# EAGLE design Controller (EAGLE 6.4)
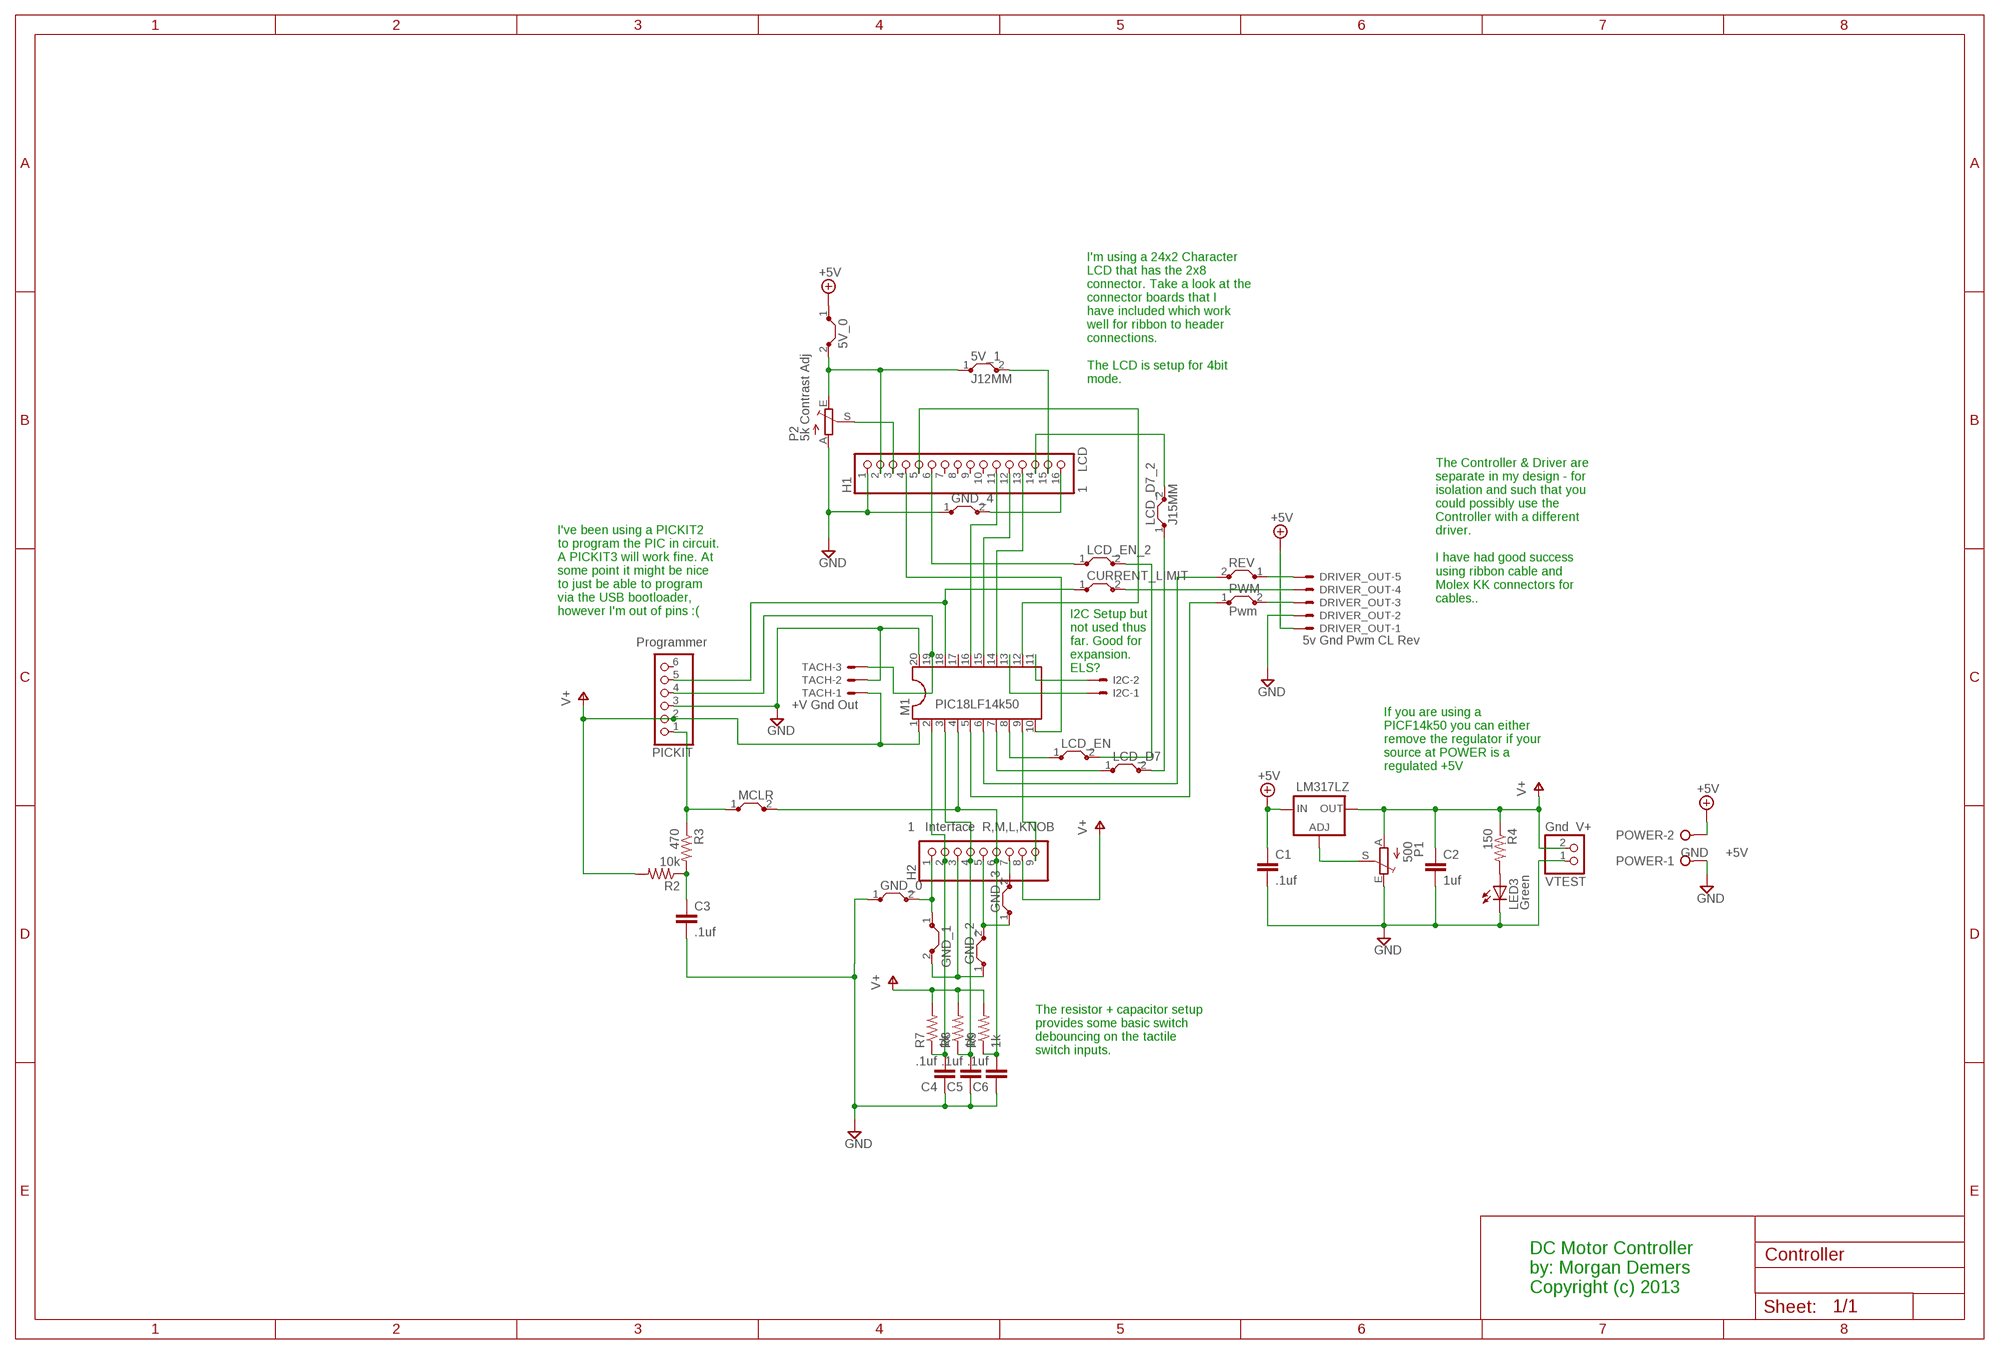
[diagram p0: schematic, sheet 1]

## Parts
5V_0  J5MM  [05]
5V_1  J12MM  [12]
C1  .1uf  C2,5-3  [C2.5-3]
C2  1uf  C2,5-3  [C2.5-3]
C3  .1uf  C2,5-3  [C2.5-3]
C4  .1uf  C5/2.5  [C5B2.5]
C5  .1uf  C5/2.5  [C5B2.5]
C6  .1uf  C5/2.5  [C5B2.5]
CURRENT_LIMIT  J30MM  [30]
DRIVER_OUT  5v Gnd Pwm CL Rev  22-23-2051  [22-23-2051]
GND_0  J10MM  [10]
GND_1  J5MM  [05]
GND_2  J5MM  [05]
GND_3  J5MM  [05]
GND_4  J10MM  [10]
H1  1 LCD  PINHD-1X16  [1X16]
H2  1 Interface R,M,L,KNOB  PINHD-1X9  [1X09]
I2C  22-23-2021  [22-23-2021]
LCD_D7  J7MM  [07]
LCD_D7_2  J15MM  [15]
LCD_EN  J7MM  [07]
LCD_EN_2  J7MM  [07]
LED3  Green  LEDLSU260  [LSU260]
LM317LZ  LM317L  [317L]
M1  PIC18LF14k50  DIL20  [DIL20]
MCLR  J15MM  [15]
P1  500  TRIM_EU-B25P  [B25P]
P2  5k Contrast Adj  TRIM_EU-B25P  [B25P]
PICKIT  Programmer  PINHD-1X6/90  [1X06/90]
POWER  GND +5V  W237-02P  [W237-132]
PWM  Pwm  J7MM  [07]
R2  10k  R-US_0204/2V  [0204V]
R3  470  R-US_0204/2V  [0204V]
R4  150  R-US_0204/2V  [0204V]
R7  1k  R-US_0204/2V  [0204V]
R8  1k  R-US_0204/2V  [0204V]
R9  1k  R-US_0204/2V  [0204V]
REV  J10MM  [10]
TACH  +V Gnd Out  22-23-2031  [22-23-2031]
VTEST  Gnd V+  PINHD-1X2  [1X02]

## Nets
+5V: 5V_0.1 C1.1 DRIVER_OUT.1 LM317LZ.3(IN) POWER.2
+5V_J0: 5V_0.2 5V_1.1 H1.2 P2.E
GND: C1.2 C2.2 C3.2 C4.1 C5.1 C6.1 DRIVER_OUT.2 GND_0.1 GND_4.1 H1.1 LED3.K(C) M1.20 P1.E P2.A PICKIT.3 POWER.1 TACH.2 VTEST.1
GND_J0: GND_0.2 GND_1.1 H2.1
GND_J1: GND_1.2 GND_2.1 H2.3
GND_J3: GND_2.2 GND_3.1 H2.5
GND_J4: GND_3.2 H2.7
LMADJ: LM317LZ.1(ADJ) P1.S
N$1: 5V_1.2 H1.15
N$2: LED3.A R4.2
N$3: GND_4.2 H1.16
S$2: MCLR.1 PICKIT.1 R3.1
S$3: I2C.2 M1.11
S$4: H2.9 M1.9
S$5: H1.3 P2.S
S$6: H1.14 LCD_D7_2.2
S$7: H1.6 LCD_EN_2.1
S$8: H1.4 M1.10
S$9: LCD_EN.2 LCD_EN_2.2
S$14: H1.5 M1.12
S$16: C4.2 H2.2 M1.2 R7.1
S$18: C3.1 R2.1 R3.2
S$19: H1.11 M1.16
S$20: LCD_EN.1 M1.8
S$21: H1.12 M1.15
S$22: H1.13 M1.14
S$23: M1.19 PICKIT.4 TACH.3
S$24: LCD_D7.1 M1.7
S$25: CURRENT_LIMIT.1 M1.18 PICKIT.5
S$26: C5.2 H2.4 M1.3 R8.1
S$27: LCD_D7.2 LCD_D7_2.1
S$30: M1.6 REV.2
S$31: I2C.1 M1.13
S$32: C6.2 H2.6 M1.4 MCLR.2 R9.1
S$34: M1.5 PWM.1
S$39: DRIVER_OUT.5 REV.1
S$40: CURRENT_LIMIT.2 DRIVER_OUT.4
S$41: DRIVER_OUT.3 PWM.2
V+: C2.1 H2.8 LM317LZ.2(OUT) M1.1 P1.A PICKIT.2 R2.2 R4.1 R7.2 R8.2 R9.2 TACH.1 VTEST.2
Unconnected: H1.7 H1.8 H1.9 H1.10 M1.17 PICKIT.6

## Notes on the sheet
- I'm using a 24x2 Character
  LCD that has the 2x8 
  connector. Take a look at the
  connector boards that I
  have included which work
  well for ribbon to header
  connections.
  
  The LCD is setup for 4bit
  mode.
- The Controller & Driver are
  separate in my design - for
  isolation and such that you
  could possibly use the 
  Controller with a different
  driver.
  
  I have had good success
  using ribbon cable and 
  Molex KK connectors for
  cables..
- I've been using a PICKIT2 
  to program the PIC in circuit.
  A PICKIT3 will work fine. At 
  some point it might be nice
  to just be able to program
  via the USB bootloader, 
  however I'm out of pins :(
- I2C Setup but
  not used thus
  far. Good for
  expansion.
  ELS?
- If you are using a
  PICF14k50 you can either
  remove the regulator if your
  source at POWER is a
  regulated +5V
- The resistor + capacitor setup
  provides some basic switch
  debouncing on the tactile
  switch inputs.
- DC Motor Controller
  by: Morgan Demers
  Copyright (c) 2013

## Library data of the parts
5V_0 5V_1 CURRENT_LIMIT GND_0 GND_1-GND_4 LCD_D7 LCD_D7_2 LCD_EN LCD_EN_2 MCLR PWM REV = jumper:J: Bridge
C1-C6 = capacitor-wima:C: CAPACITOR naming: grid - package width
DRIVER_OUT = con-molex:22-23-2051: .100" (2.54mm) Center Header - 5 Pin; MF: MOLEX; MPN: 22-23-2051; OC_FARNELL: 1462952; OC_NEWARK: 38C9178
H1 = pinhead:PINHD-1X16: PIN HEADER
H2 = pinhead:PINHD-1X9: PIN HEADER
I2C = con-molex:22-23-2021: .100" (2.54mm) Center Header - 2 Pin; MF: MOLEX; MPN: 22-23-2021; OC_FARNELL: 1462926; OC_NEWARK: 25C3832
LED3 = led:LED: LED OSRAM: - CHIPLED LG R971, LG N971, LY N971, LG Q971, LY Q971, LO R971, LY R971 LH N974, LH R974 LS Q976, LO Q976, LY Q976 LO Q996 - Hyper CHIPLED LW Q18S LB Q993, LB Q99A, LB R99A - SideLED LS A670, LO A670, LY A670, LG A670, LP A670 LB A673, LV A673, LT A673, LW A673 LH A674 LY A675 LS A676, LA A676, LO A676, LY A676, LW A676 LS A679, LY A679, LG A679 - Hyper Micro SIDELED® LS Y876, LA Y876, LO Y876, LY Y876 LT Y87S - SmartLED LW L88C, LW L88S LB L89C, LB L89S, LG L890 LS L89K, LO L89K, LY L89K LS L896, LA L896, LO L896, LY L896 - TOPLED LS T670, LO T670, LY T670, LG T670, LP T670 LSG T670, LSP T670, LSY T670, LOP T670, LYG T670 LG T671, LOG T671, LSG T671 LB T673, LV T673, LT T673, LW T673 LH T674 LS T676, LA T676, LO T676, LY T676, LB T676, LH T676, LSB T676, LW T676 LB T67C, LV T67C, LT T67C, LS T67K, LO T67K, LY T67K, LW E67C LS E67B, LA E67B, LO E67B, LY E67B, LB E67C, LV E67C, LT E67C LW T67C LS T679, LY T679, LG T679 LS T770, LO T770, LY T770, LG T770, LP T770 LB T773, LV T773, LT T773, LW T773 LH T774 LS E675, LA E675, LY E675, LS T675 LS T776, LA T776, LO T776, LY T776, LB T776 LHGB T686 LT T68C, LB T68C - Hyper Mini TOPLED® LB M676 - Mini TOPLED Santana® LG M470 LS M47K, LO M47K, LY M47K Source: http://www.osram.convergy.de LUXEON: - LUMILED® LXK2-PW12-R00, LXK2-PW12-S00, LXK2-PW14-U00, LXK2-PW14-V00 LXK2-PM12-R00, LXK2-PM12-S00, LXK2-PM14-U00 LXK2-PE12-Q00, LXK2-PE12-R00, LXK2-PE12-S00, LXK2-PE14-T00, LXK2-PE14-U00 LXK2-PB12-K00, LXK2-PB12-L00, LXK2-PB12-M00, LXK2-PB14-N00, LXK2-PB14-P00, LXK2-PB14-Q00 LXK2-PR12-L00, LXK2-PR12-M00, LXK2-PR14-Q00, LXK2-PR14-R00 LXK2-PD12-Q00, LXK2-PD12-R00, LXK2-PD12-S00 LXK2-PH12-R00, LXK2-PH12-S00 LXK2-PL12-P00, LXK2-PL12-Q00, LXK2-PL12-R00 Source: www.luxeon.com KINGBRIGHT: KA-3528ASYC Source: www.kingbright.com
LM317LZ = v-reg:LM317L: VOLTAGE REGULATOR
M1 = ic-package:DIL20: Dual In Line / Socket
P1 P2 = pot:TRIM_EU-: POTENTIOMETER
PICKIT = pinhead:PINHD-1X6: PIN HEADER
POWER = con-wago-508:W237-02P: WAGO SREW CLAMP; OC_FARNELL: unknown; OC_NEWARK: unknown
R2-R4 R7-R9 = resistor:R-US_: RESISTOR, American symbol
TACH = con-molex:22-23-2031: .100" (2.54mm) Center Header - 3 Pin; MF: MOLEX; MPN: 22-23-2031; OC_FARNELL: 1462950; OC_NEWARK: 30C0862
VTEST = pinhead:PINHD-1X2: PIN HEADER

## Board
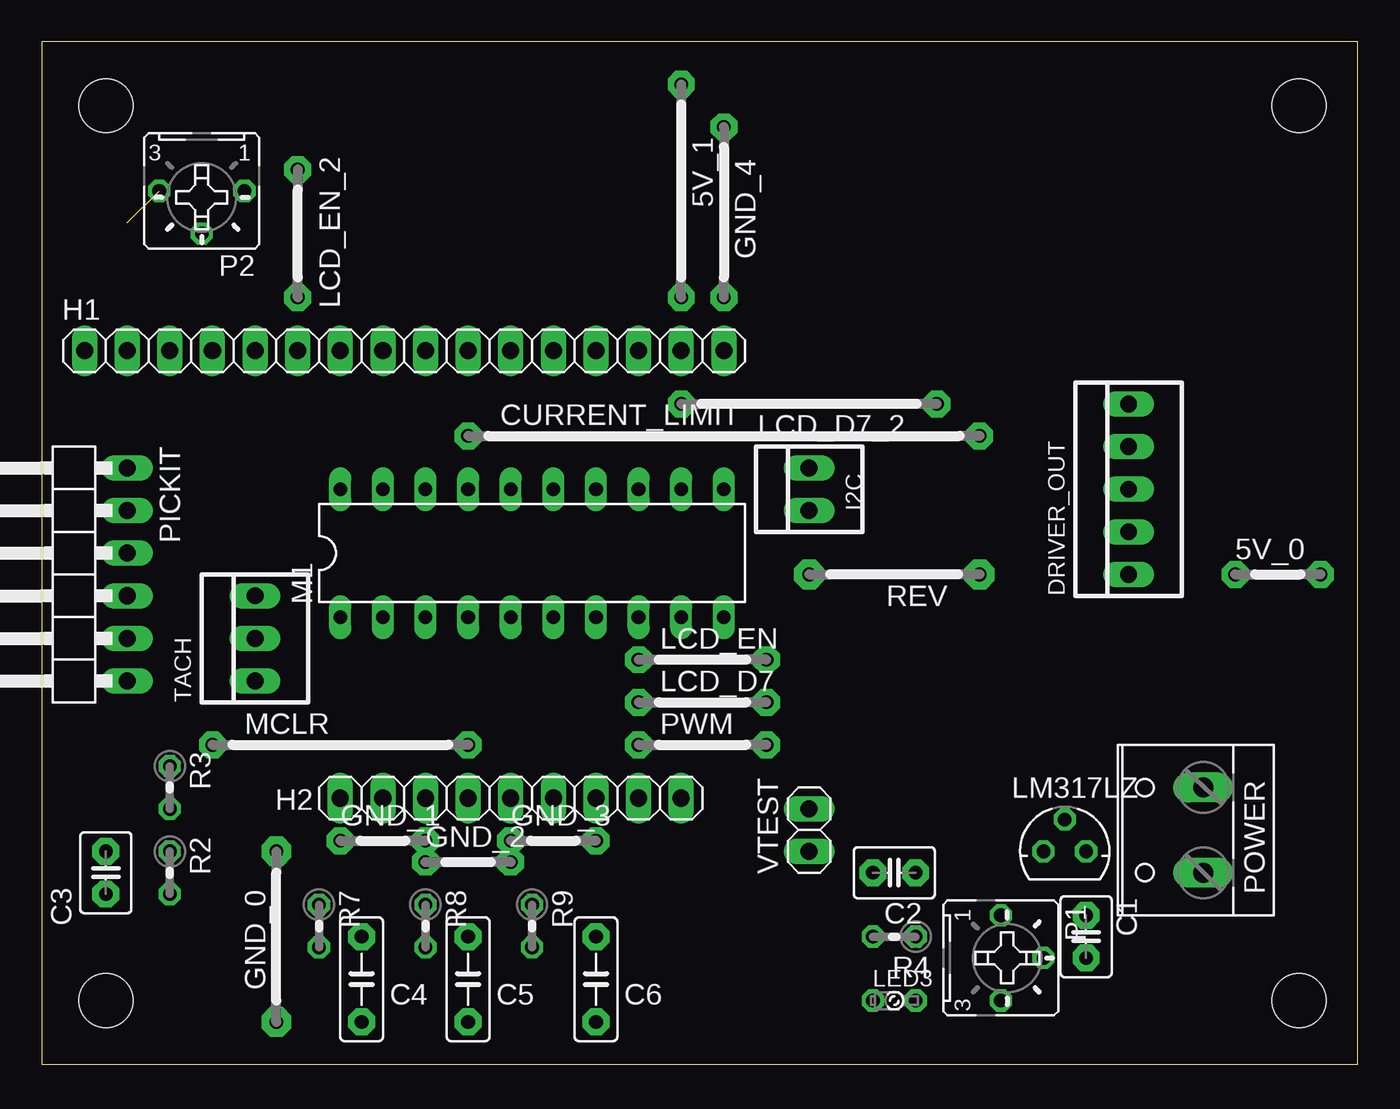
[diagram p1: board, top side]
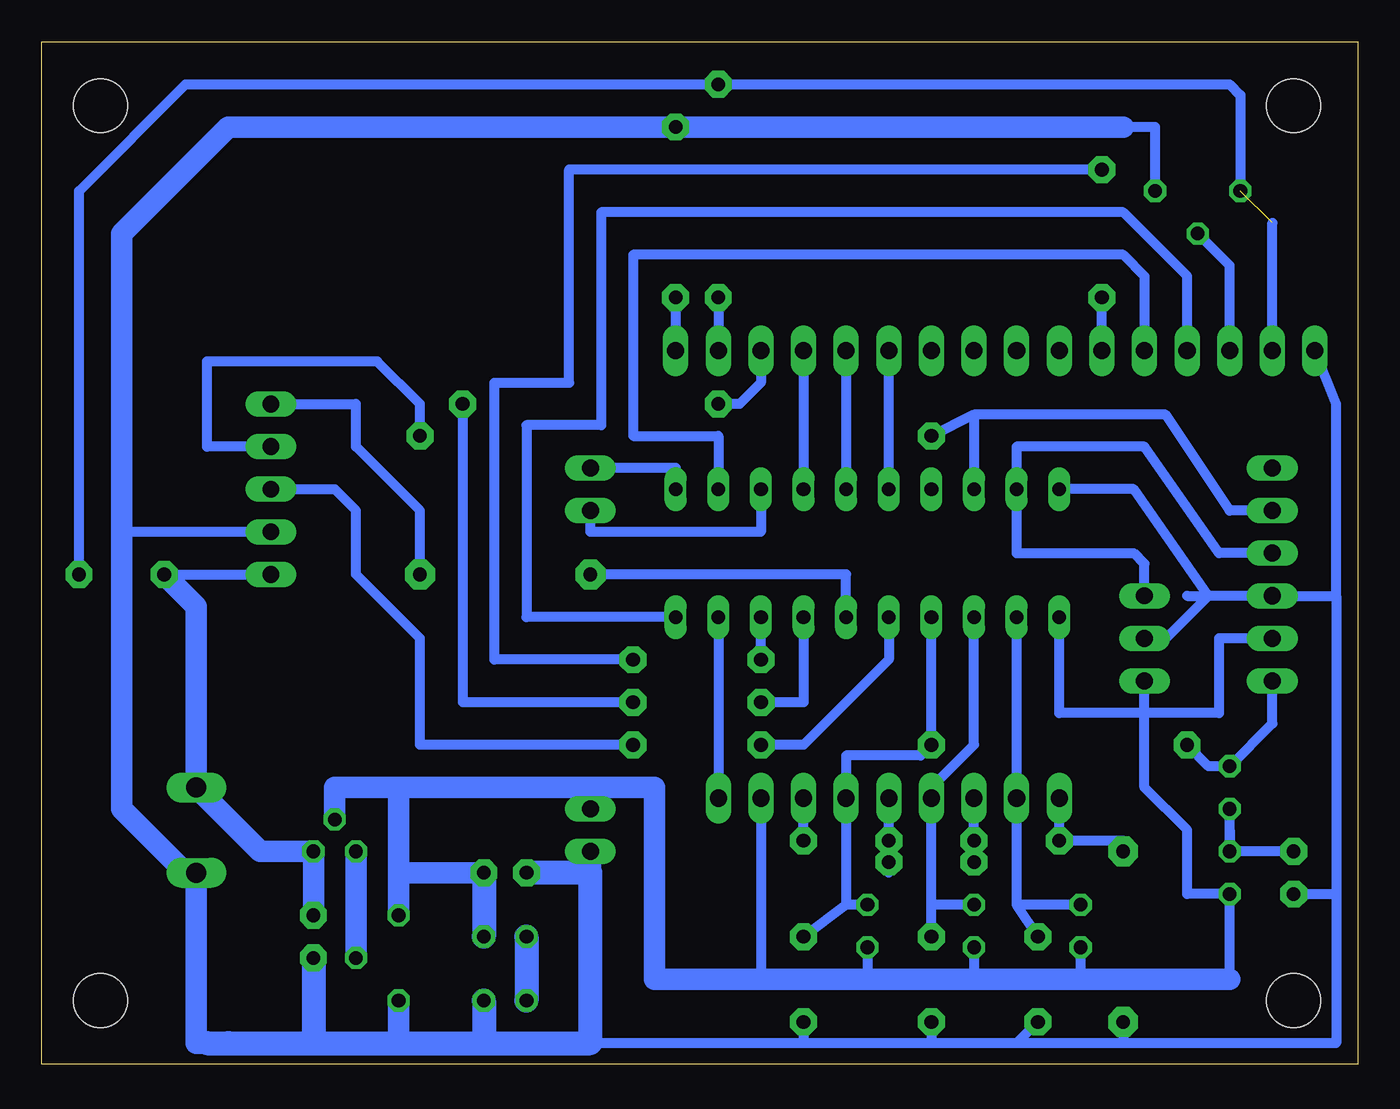
[diagram p2: board, bottom side, seen from below]

Size 78.41 x 60.95 mm. Coordinates in mm from the lower left corner, seen from the top.
Outline: 0,0 78.41,0 78.41,60.95 0,60.95 0,0
Copper layers (1*16): Top 0.035mm / dielectric 1.5mm / Bottom 0.035mm
Design rules "default": minimum track width 10mil, minimum drill 24mil, track to track 8mil, track to pad 8mil, pad to pad 8mil, via to via 8mil, smd to smd 8mil, copper to edge 40mil, drill to drill 8mil, minimum pad ring 10mil, minimum via ring 8mil, stop-mask expansion 4mil, vias tented up to drill 0mil, thermal gap 10mil
Holes 3.2 mm at 3.81,57.15 74.93,57.15 74.93,3.81 3.81,3.81

### Footprints (pad centres in the part's own frame; a part is rotated, then mirrored left to right if it is on the bottom)
05 = drill 0.813 pad 1.6 octagon: 1 -2.54,0; 2 2.54,0
12 = drill 0.813 pad 1.6 octagon: 1 -6.35,0; 2 6.35,0
C2.5-3 = drill 0.813 pad 1.6 octagon: 1 -1.27,0; 2 1.27,0
C5B2.5 = drill 0.813 pad 1.6 octagon: 1 -2.54,0; 2 2.54,0
30 = drill 0.813 pad 1.6 octagon: 1 -15.24,0; 2 15.24,0
22-23-2051 = drill 1 long: 1 -5.08,0; 2 -2.54,0; 3 0,0; 4 2.54,0; 5 5.08,0
10E = drill 0.813 pad 1.778 octagon: 1 -5.08,0; 2 5.08,0
10 = drill 0.813 pad 1.6 octagon: 1 -5.08,0; 2 5.08,0
1X16 = drill 1.016 long: 1 -19.05,0; 2 -16.51,0; 3 -13.97,0; 4 -11.43,0; 5 -8.89,0; 6 -6.35,0; 7 -3.81,0; 8 -1.27,0; 9 1.27,0; 10 3.81,0; 11 6.35,0; 12 8.89,0; 13 11.43,0; 14 13.97,0; 15 16.51,0; 16 19.05,0
1X09 = drill 1.016 long: 1 -10.16,0; 2 -7.62,0; 3 -5.08,0; 4 -2.54,0; 5 0,0; 6 2.54,0; 7 5.08,0; 8 7.62,0; 9 10.16,0
22-23-2021 = drill 1 long: 1 -1.27,0; 2 1.27,0
07 = drill 0.813 pad 1.6 octagon: 1 -3.81,0; 2 3.81,0
15 = drill 0.813 pad 1.6 octagon: 1 -7.62,0; 2 7.62,0
LSU260 = drill 0.813 octagon: A -1.27,0; K 1.27,0
317L = drill 0.813 octagon: 1 -1.27,0; 2 0,1.905; 3 1.27,0
DIL20 = drill 0.813 long: 1 -11.43,-3.81; 2 -8.89,-3.81; 3 -6.35,-3.81; 4 -3.81,-3.81; 5 -1.27,-3.81; 6 1.27,-3.81; 7 3.81,-3.81; 8 6.35,-3.81; 9 8.89,-3.81; 10 11.43,-3.81; 11 11.43,3.81; 12 8.89,3.81; 13 6.35,3.81; 14 3.81,3.81; 15 1.27,3.81; 16 -1.27,3.81; 17 -3.81,3.81; 18 -6.35,3.81; 19 -8.89,3.81; 20 -11.43,3.81
B25P = drill 0.813 octagon: A -2.54,0; E 2.54,0; S 0,2.54
1X06/90 = drill 1.016 long: 1 -6.35,-3.81; 2 -3.81,-3.81; 3 -1.27,-3.81; 4 1.27,-3.81; 5 3.81,-3.81; 6 6.35,-3.81
W237-132 = drill 1.194 long: 1 -2.54,-0.635; 2 2.54,-0.635
0204V = drill 0.813 octagon: 1 -1.27,0; 2 1.27,0
22-23-2031 = drill 1 long: 1 -2.54,0; 2 0,0; 3 2.54,0
1X02 = drill 1.016 long: 1 -1.27,0; 2 1.27,0

### Placement (x,y rotation side)
5V_0  73.66,29.21 0 top
5V_1  38.1,52.07 270 top
C1  62.23,7.62 270 top
C2  50.8,11.43 180 top
C3  3.81,11.43 270 top
C4  19.05,5.08 90 top
C5  25.4,5.08 90 top
C6  33.02,5.08 90 top
CURRENT_LIMIT  40.64,37.47 0 top
DRIVER_OUT  64.77,34.29 90 top
GND_0  [10E]  13.97,7.62 90 top
GND_1  20.32,13.34 0 top
GND_2  25.4,12.06 0 top
GND_3  30.48,13.34 0 top
GND_4  40.64,50.8 270 top
H1  21.59,42.55 0 top
H2  27.94,15.88 0 top
I2C  45.72,34.29 90 top
LCD_D7  39.37,21.59 0 top
LCD_D7_2  45.72,39.37 180 top
LCD_EN  39.37,24.13 0 top
LCD_EN_2  15.24,49.53 90 top
LED3  50.8,3.81 0 top
LM317LZ  60.96,12.7 0 top
M1  29.21,30.48 0 top
MCLR  17.78,19.05 0 top
P1  57.15,6.35 270 top
P2  9.53,52.07 180 top
PICKIT  1.27,29.21 90 top
POWER  68.58,13.97 90 top
PWM  39.37,19.05 0 top
R2  7.62,11.43 270 top
R3  7.62,16.51 270 top
R4  50.8,7.62 180 top
R7  16.51,8.26 270 top
R8  22.86,8.26 270 top
R9  29.21,8.26 270 top
REV  [10E]  50.8,29.21 180 top
TACH  12.7,25.4 90 top
VTEST  45.72,13.97 90 top

### Tracks (layer width: path | path; a pad name or v marks a point on that pad's centre or on a via)
+5V
  Bottom 0.61: 5V_0.1 DRIVER_OUT.1
  Bottom 1.27: C1.1 LM317LZ.3 65.41,12.7 POWER.2 69.22,27.3 5V_0.1
+5V_J0  (1 unrouted)
  Bottom 0.61: H1.2 5.08,50.16 | P2.E 6.99,57.78 7.62,58.42 5V_1.1 69.85,58.42 76.2,52.07 5V_0.2
GND
  Bottom 0.61: 1.27,27.94 PICKIT.3 8.89,27.94 | 1.27,27.94 1.27,10.16 | 1.27,10.16 1.27,1.27 13.97,1.27 | 10.16,27.94 8.89,27.94 | 8.89,27.94 13.34,34.29 M1.20 | 1.27,27.94 1.27,39.37 H1.1 | C3.2 1.27,10.16 | 13.97,1.27 20.32,1.27 | 20.32,1.27 25.4,1.27 | 25.4,1.27 33.02,1.27 | 33.02,1.27 45.72,1.27 | C4.1 20.32,1.27 | C5.1 25.4,1.27 | C6.1 33.02,1.27 | GND_0.1 13.97,1.27 | 8.89,27.94 11.43,25.4 TACH.2 | 15.88,55.88 13.97,55.88 12.06,55.88 P2.A | DRIVER_OUT.2 73.66,31.75
  Bottom 1.27: P1.E 57.15,1.27 | 45.72,11.43 VTEST.1 | 67.31,1.27 69.22,1.27 POWER.1 69.85,11.43 73.66,15.24 73.66,31.75 73.66,49.53 67.31,55.88 43.18,55.88 GND_4.1 13.97,55.88 | 15.88,55.88 14.61,55.88
  Bottom 1.422: 68.58,1.27 67.31,1.27 62.23,1.27 | 62.23,1.27 57.15,1.27 52.07,1.27 | 52.07,1.27 45.72,1.27 45.72,11.43 C2.2 | C1.2 62.23,1.27 | LED3.K 52.07,1.27
GND_J0
  Bottom 0.61: GND_0.2 13.97,13.34 GND_1.1 H2.1
GND_J1
  Bottom 0.61: H2.3 GND_1.2 GND_2.1
GND_J3
  Bottom 0.61: H2.5 GND_3.1 GND_2.2 27.94,11.43
GND_J4
  Bottom 0.61: GND_3.2 H2.7
LMADJ
  Bottom 1.27: LM317LZ.1 P1.S
N$1
  Bottom 0.61: 5V_1.2 H1.15
N$2
  Bottom 1.422: R4.2 LED3.A
N$3
  Bottom 0.61: GND_4.2 H1.16
S$2
  Bottom 0.61: PICKIT.1 5.08,20.32 R3.1 8.89,17.78 MCLR.1
S$3
  Bottom 0.61: M1.11 40.64,35.56 I2C.2
S$4
  Bottom 0.61: M1.9 H2.9
S$5
  Bottom 0.61: H1.3 7.62,47.62 P2.S
S$6
  Bottom 0.61: H1.14 35.56,40.64 36.83,39.37 LCD_D7_2.2
S$7
  Bottom 0.61: H1.6 LCD_EN_2.1
S$8
  Bottom 0.61: H1.4 10.16,46.99 13.97,50.8 45.09,50.8 45.09,38.1 49.53,38.1 49.53,26.67 M1.10
S$9
  Bottom 0.61: LCD_EN.2 51.44,24.13 51.44,40.64 46.99,40.64 46.99,53.34 LCD_EN_2.2
S$14
  Bottom 0.61: M1.12 38.1,37.47 43.18,37.47 43.18,48.26 13.97,48.26 12.7,46.99 H1.5
S$16
  Bottom 0.61: M1.2 H2.2 20.32,9.53 | 20.32,9.53 C4.2 | R7.1 20.32,9.53
S$18
  Bottom 0.61: C3.1 R2.1 | 7.62,13.97 R2.1 | R3.2 7.62,14.61 R2.1
S$19
  Bottom 0.61: M1.16 H1.11
S$20
  Bottom 0.61: LCD_EN.1 M1.8
S$21
  Bottom 0.61: H1.12 M1.15
S$22
  Bottom 0.61: H1.13 M1.14
S$23
  Bottom 0.61: PICKIT.4 8.26,30.48 12.7,36.83 20.32,36.83 M1.19 20.32,30.48 13.34,30.48 12.7,29.84 TACH.3
S$24
  Bottom 0.61: M1.7 33.02,21.59 LCD_D7.1
S$25
  Bottom 0.61: 22.86,38.73 M1.18 | 22.86,38.73 11.43,38.73 7.62,33.02 PICKIT.5 | 22.86,38.73 CURRENT_LIMIT.1
S$26
  Bottom 0.61: C5.2 25.4,9.53 | 25.4,9.53 H2.4 25.4,16.51 22.86,19.05 M1.3 | R8.1 25.4,9.53
S$27
  Bottom 0.61: LCD_D7.2 53.34,21.59 LCD_D7_2.1
S$30
  Bottom 0.61: M1.6 30.48,29.21 REV.2
S$31
  Bottom 0.61: M1.13 35.56,31.75 45.72,31.75 I2C.1
S$32
  Bottom 0.61: 30.48,9.53 H2.6 30.48,18.41 26.04,18.41 MCLR.2 M1.4 | 30.48,9.53 C6.2 | R9.1 30.48,9.53
S$34
  Bottom 0.61: M1.5 27.94,24.13 33.02,19.05 PWM.1
S$39
  Bottom 0.61: REV.1 55.88,33.02 59.69,36.83 59.69,39.37 DRIVER_OUT.5
S$40
  Bottom 0.61: DRIVER_OUT.4 68.58,36.83 68.58,41.91 58.42,41.91 55.88,39.37 CURRENT_LIMIT.2
S$41
  Bottom 0.61: PWM.2 55.88,19.05 55.88,25.4 59.69,29.21 59.69,33.02 60.96,34.29 DRIVER_OUT.3
V+
  Bottom 0.61: 7.62,5.08 R2.2 10.16,10.16 10.16,13.97 12.7,16.51 12.7,20.95 | H2.8 35.56,5.08 | R7.2 16.51,5.08 | R8.2 22.86,5.08 | R9.2 29.21,5.08 | PICKIT.2 8.26,25.4 8.26,20.95 12.7,20.95 | M1.1 17.78,20.95 12.7,20.95 | 12.7,20.95 TACH.1
  Bottom 1.27: 57.15,16.51 57.15,11.43 | 57.15,11.43 P1.A | C2.1 57.15,11.43 | 57.15,16.51 45.72,16.51 | 45.72,16.51 41.91,16.51 41.91,5.08 35.56,5.08 29.21,5.08 22.86,5.08 16.51,5.08 7.62,5.08 | 45.72,16.51 VTEST.2 | 57.15,16.51 60.96,16.51 LM317LZ.2
  Bottom 1.422: C2.1 R4.1

### Text on the board
tDocu: DC Motor Controller | v2.1 | by Morgan Demers | 3.4v regulator | for LF series | 1 | PIC Only | 3.4v